# EAGLE design AST1037 (EAGLE 6.3)
DATABASE: ./../../../../../Components/TinyCircuits_Part_Database.txt
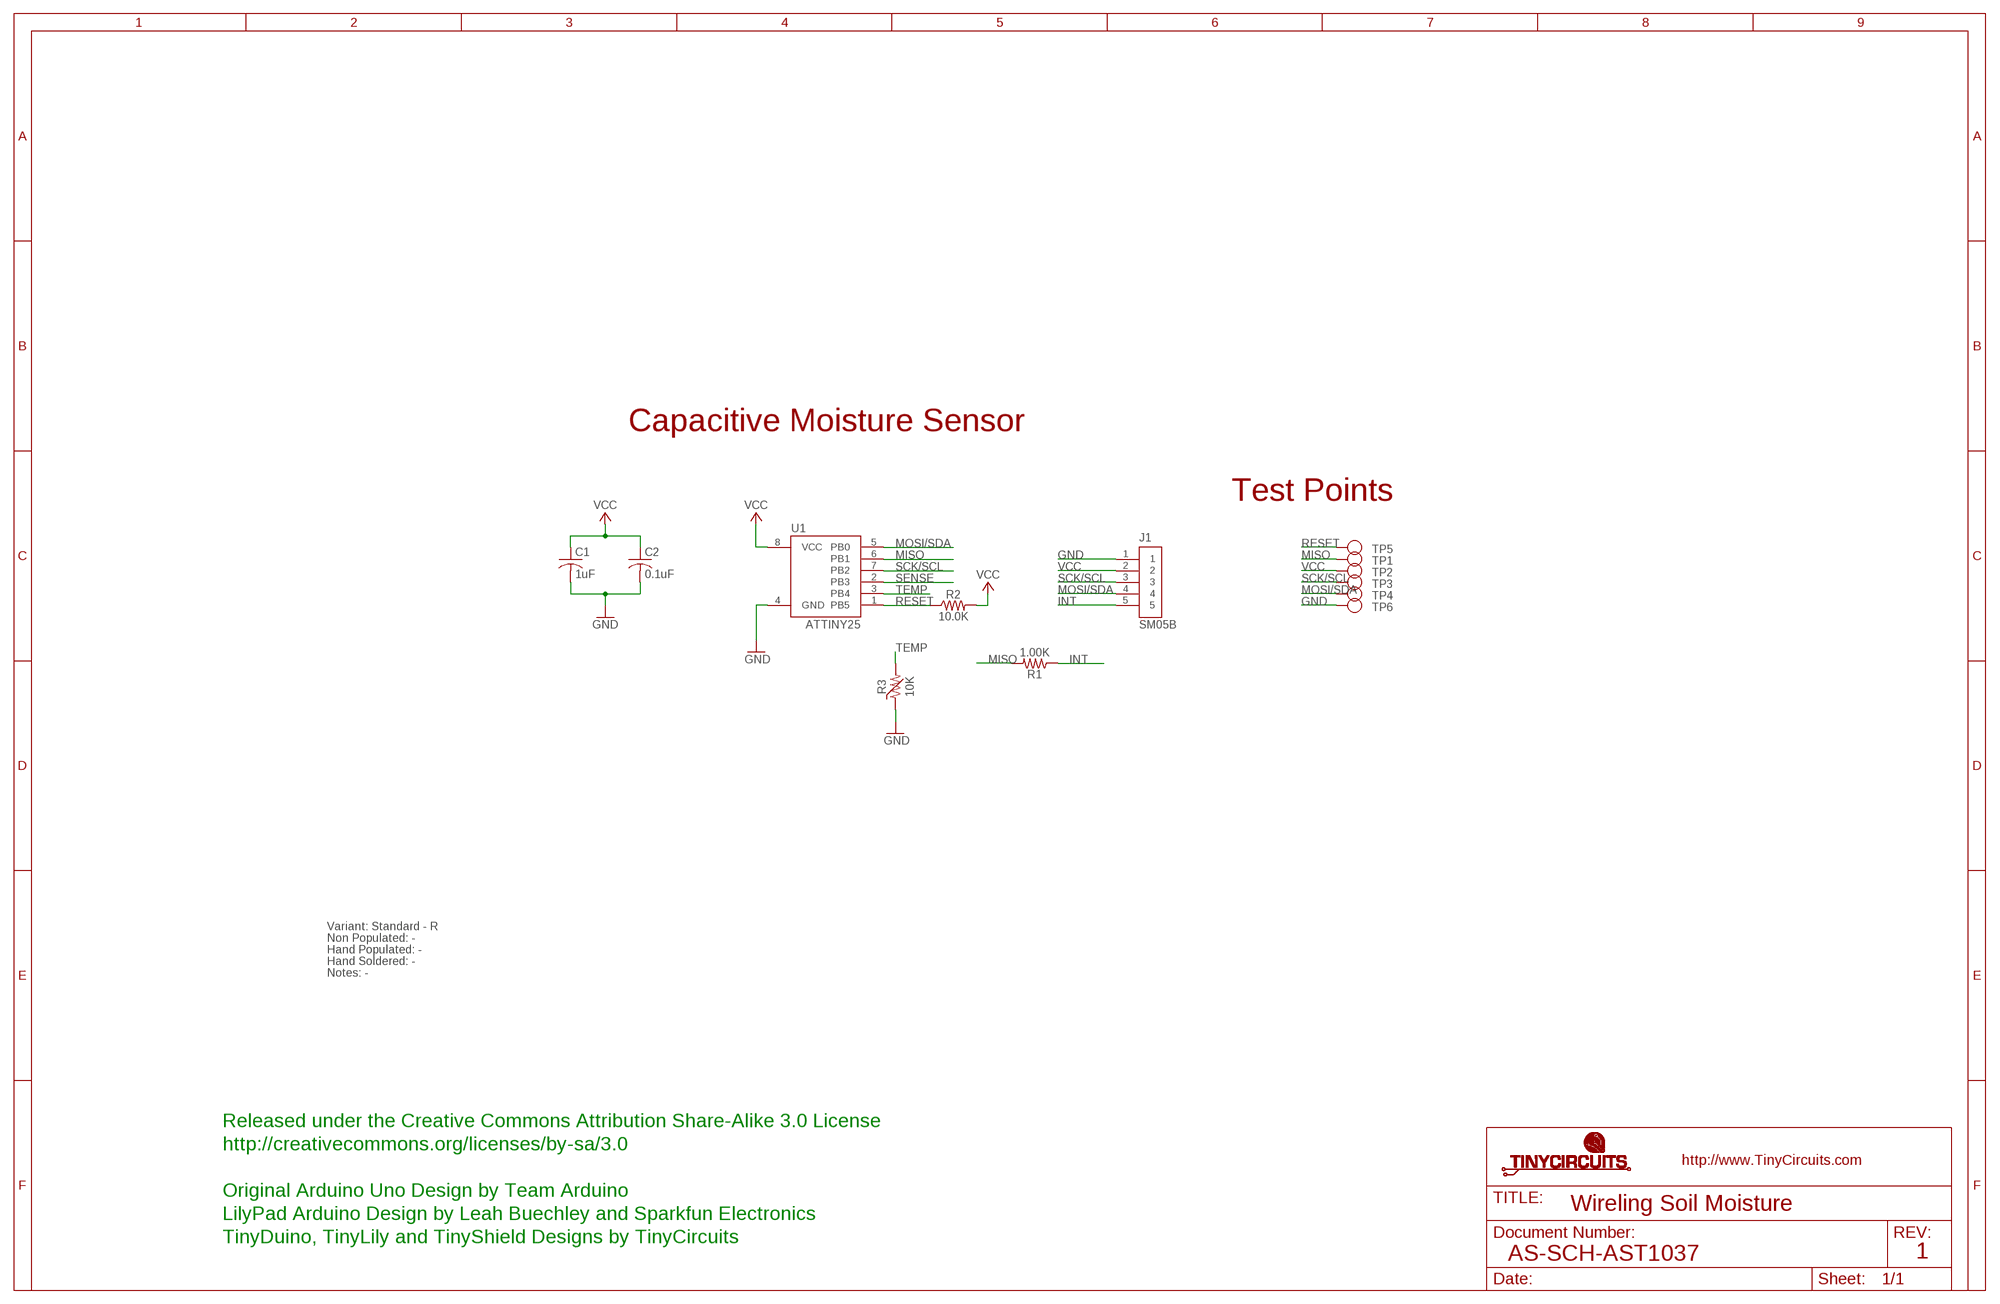
[diagram p0: schematic, sheet 1]

## Parts
C1  1uF  AS-ITM-00410  [C0603]
C2  0.1uF  AS-ITM-00008  [C0402]
J1  SM05B  AS-ITM-00340  [JST_SH_5X1]
R1  1.00K  AS-ITM-00003  [0402]
R2  10.0K  AS-ITM-00032  [0402]
R3  10K  AS-ITM-00524  [0402]
TP1  TEST_POINT  [TEST_POINT_1MM]
TP2  TEST_POINT  [TEST_POINT_1MM]
TP3  TEST_POINT  [TEST_POINT_1MM]
TP4  TEST_POINT  [TEST_POINT_1MM]
TP5  TEST_POINT  [TEST_POINT_1MM]
TP6  TEST_POINT  [TEST_POINT_1MM]
U1  ATTINY25  AS-ITM-00330  [SO-08-COMPACT]

## Nets
GND: C1.2 C2.2 J1.1 R3.1 TP6.P$1 U1.4(GND)
INT: J1.5 R1.1
MISO: R1.2 TP1.P$1 U1.6(PB1)
MOSI/SDA: J1.4 TP4.P$1 U1.5(PB0)
RESET: R2.1 TP5.P$1 U1.1(PB5)
SCK/SCL: J1.3 TP3.P$1 U1.7(PB2)
SENSE: U1.2(PB3)
TEMP: R3.2 U1.3(PB4)
VCC: C1.1 C2.1 J1.2 R2.2 TP2.P$1 U1.8(VCC)

## Notes on the sheet
- Capacitive Moisture Sensor
- Test Points
- Variant: Standard - R
- Non Populated: -
- Hand Populated: -
- Hand Soldered: -
- Notes: -
- Released under the Creative Commons Attribution Share-Alike 3.0 License
- http://creativecommons.org/licenses/by-sa/3.0
- Original Arduino Uno Design by Team Arduino
- Wireling Soil Moisture
- LilyPad Arduino Design by Leah Buechley and Sparkfun Electronics
- TinyDuino, TinyLily and TinyShield Designs by TinyCircuits
- AS-SCH-AST1037 | 1

## Library data of the parts
C1 = tinycircuits:AS-ITM-00410: CAP CER 1UF 10V X5R 0603; PARTNO: AS-ITM-00410
C2 = tinycircuits:AS-ITM-00008: CAP CER 0.1UF 16V 10% X5R 0402; PARTNO: AS-ITM-00008
J1 = tinycircuits:AS-ITM-00340: CONN HEADER SH 5POS SIDE 1MM TIN; PARTNO: AS-ITM-00340; PNPROTATION: 180
R1 = tinycircuits:AS-ITM-00003: RES 1.00K OHM 1/16W 1% 0402; PARTNO: AS-ITM-00003
R2 = tinycircuits:AS-ITM-00032: RES 10.0K OHM 1/16W 1% 0402 SMD; PARTNO: AS-ITM-00032
R3 = tinycircuits:AS-ITM-00524: THERMISTOR NTC 10KOHM 3380K 0402; PARTNO: AS-ITM-00524
TP1-TP6 = tinycircuits:TEST_POINT: Test point, no drill
U1 = tinycircuits:AS-ITM-00330: MCU AVR ATtiny Microcontroller IC 8-Bit 20MHz 2KB (1K x 16) FLASH 8-SOIC; PARTNO: AS-ITM-00330

## Net classes
2 gnd: width 0.305 mm, drill 0.559 mm, clearance 0.254 mm

## Board
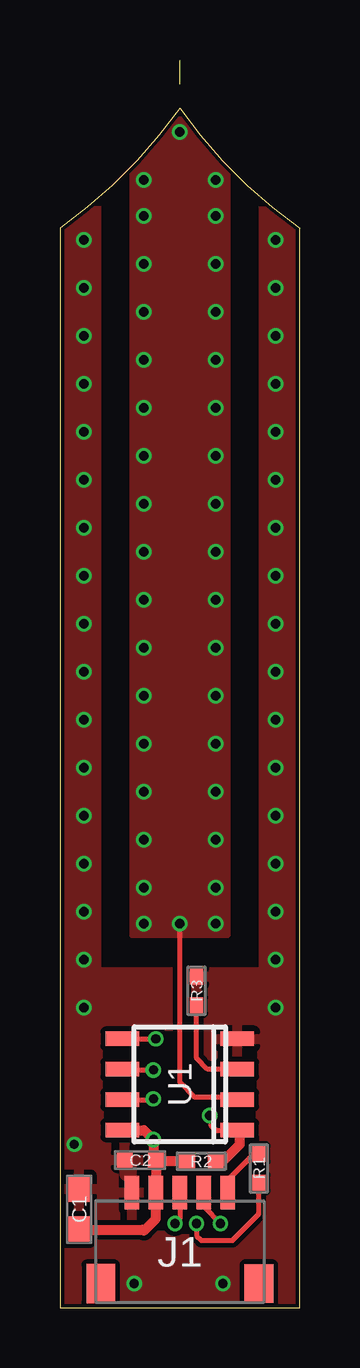
[diagram p1: board, top side]
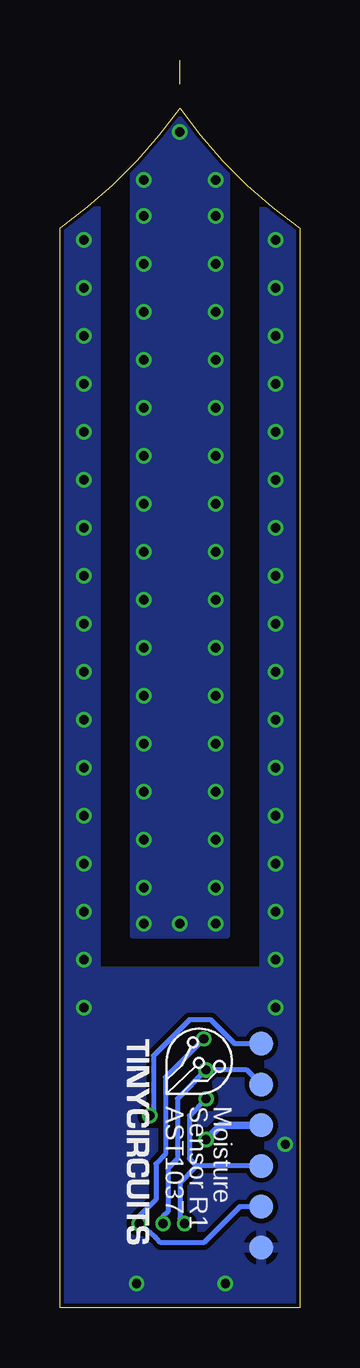
[diagram p2: board, bottom side, seen from below]

Size 10 x 52 mm. Coordinates in mm from the lower left corner, seen from the top.
Outline: 5,51 5,52
Outline: 0,0 10,0 10,45 arc-20 5,50 arc-20 0,45 0,0
Copper layers (1*16): Top 0.035mm / dielectric 1.5mm / Bottom 0.035mm
Design rules "default *": minimum track width 8mil, minimum drill 15mil, track to track 8mil, track to pad 8mil, pad to pad 8mil, via to via 8mil, smd to smd 8mil, copper to edge 6mil, drill to drill 8mil, minimum pad ring 8mil, minimum via ring 5mil, stop-mask expansion 4mil, vias tented up to drill 25mil, thermal gap 10mil

### Footprints (pad centres in the part's own frame; a part is rotated, then mirrored left to right if it is on the bottom)
C0603 = smd 1.1 x 1: 1 -0.85,0; 2 0.85,0
C0402 = smd 0.65 x 0.6: 1 -0.65,0; 2 0.65,0
JST_SH_5X1 = smd 0.6 x 1.4: 1 -2,2.475; 2 -1,2.475; 3 0,2.475; 4 1,2.475; 5 2,2.475 | smd 1.2 x 1.6: PAD1 -3.3,-1.325; PAD2 3.3,-1.325
0402 = smd 0.65 x 0.55: 1 -0.6,0; 2 0.6,0
TEST_POINT_1MM = smd 1 x 1: P$1 0,0
SO-08-COMPACT = smd 0.6 x 1.4: 1 -1.905,-2.4; 2 -0.635,-2.4; 3 0.635,-2.4; 4 1.905,-2.4; 5 1.905,2.4; 6 0.635,2.4; 7 -0.635,2.4; 8 -1.905,2.4

### Placement (x,y rotation side)
C1  0.8,4.1 90 top
C2  3.35,6.15 180 top
J1  5,2.33 0 top
R1  8.3,5.8 270 top
R2  5.9,6.1 180 top
R3  5.7,13.2 270 top
TP1  1.6,9.3 0 bottom
TP2  1.6,7.6 0 bottom
TP3  1.6,5.9 0 bottom
TP4  1.6,4.2 0 bottom
TP5  1.6,11 0 bottom
TP6  1.6,2.5 0 bottom
U1  5,9.3 90 top
U$1  [DOCFIELD-TINYCIRCUITS-PCB]  24,-5 0 top  (outside the outline)

### Tracks (layer width: path | path; a pad name or v marks a point on that pad's centre or on a via)
GND  (via drill 0.38)
  other vias: 0.6,6.8 3.1,1 6.8,1 1,16.5 1,18.5 1,20.5 1,22.5 1,24.5 1,26.5 1,28.5 1,30.5 1,32.5 1,34.5 1,36.5 1,38.5 1,40.5 1,42.5 1,44.5 9,16.5 9,18.5 9,20.5 9,22.5 9,24.5 9,26.5 9,28.5 9,30.5 9,32.5 9,34.5 9,36.5 9,38.5 9,40.5 9,42.5 9,44.5 9,14.5 1,14.5 1,12.5 9,12.5
  pour Top: 0,0 0,47.5 1.5,47.5 1.5,14 8.5,14 8.5,48 10,48 10,0
  pour Bottom: 0,0 0,47.5 1.5,47.5 1.5,14 8.5,14 8.5,48 10,48 10,0
INT
  Top 0.203: J1.5 7.1,4.9 7.1,5.4 8.1,6.4 R1.1
MISO  (via drill 0.38)
  Top 0.203: 2.63,9.9 v3.9,9.9 | v5.7,3.5 5.7,3 5.9,2.8 7.2,2.8 8.3,3.9 R1.2
  Top 0.305: U1.6 2.63,9.9
  Bottom 0.203: TP1.P$1 2.2,9.9 v3.9,9.9 5.1,8.7 5.1,6.2 5.5,5.8 5.5,4 5.7,3.8 v5.7,3.5
MOSI/SDA  (via drill 0.38)
  Top 0.203: J1.4 6,4.2 v6.7,3.5 | U1.5 v4,11.2
  Top 0.305: U1.5
  Bottom 0.203: TP4.P$1 2.5,4.2 4,2.7 5.8,2.7 6,2.9 v6.7,3.5 6.7,3.8 6,4.5 6,6 5.6,6.4 5.6,9.6 v4,11.2
RESET  (via drill 0.38)
  Top 0.203: v6.25,8 6.3,7.6 6.5,7.39 U1.1
  Top 0.406: R2.1 6.8,6.1 7.5,6.8 7.5,7.29 U1.1
  Bottom 0.203: TP5.P$1 2.7,11 3.7,12 4.6,12 6.1,10.5 6.1,8.2 v6.25,8
SCK/SCL  (via drill 0.38)
  Top 0.203: J1.3 5,3.7 v4.8,3.5 | U1.7 3.87,8.66 v3.9,8.7
  Bottom 0.203: TP3.P$1 4.3,5.9 | 4.3,5.9 5,5.2 5,3.7 v4.8,3.5 | v3.9,8.7 4.6,8 4.6,6.2 4.3,5.9
SENSE  (via drill 0.38)
  Top 0.203: U1.2 6.9,8.7 6.84,8.77 5.63,8.77 5,9.4 v5,16
  other vias: 3.5,17.5 3.5,16 6.5,16 3.5,19.5 6.5,17.5 6.5,19.5 6.5,21.5 6.5,23.5 3.5,21.5 3.5,23.5 3.5,25.5 3.5,27.5 3.5,29.5 3.5,31.5 3.5,33.5 3.5,35.5 3.5,37.5 3.5,39.5 3.5,41.5 3.5,43.5 3.5,45.5 3.5,47 5,49 6.5,47 6.5,45.5 6.5,43.5 6.5,25.5 6.5,27.5 6.5,29.5 6.5,31.5 6.5,33.5 6.5,35.5 6.5,37.5 6.5,39.5 6.5,41.5
  pour Top: 3,50 7,50 7,15.5 3,15.5
  pour Bottom: 3,50 7,50 7,15.5 3,15.5
TEMP
  Top 0.203: U1.3 6.16,9.94 5.7,10.4 R3.2
VCC  (via drill 0.38)
  Top 0.406: U1.8 3.51,7.39 v3.9,7 3.9,6.2 C2.1 | C2.1 J1.2 4,3.7 3.5,3.2 3.45,3.25 C1.1 | R2.2 4.05,6.1 C2.1
  Bottom 0.305: TP2.P$1 3.3,7.6 v3.9,7

### Text on the board
bPlace: Moisture | Sensor R1 | AST1037
Document: FABRICATION DRAWING | NOTES: | 1. PRINTED CIRCUIT BOARD MADE FROM NEMA GRADE FR-4 EPOXY LAMINATE | WITH 1 OUNCE COPPER PLATING AND .024 THICKNESS. | 2. ALL DIMENSIONS ARE GIVEN IN MILLIMETERS. | 3. CIRCUIT PATHS ARE FOR REFERENCE ONLY. | 4. HOLE SIZES SHOWN ARE FINISHED DIAMETERS AFTER PLATING. | 5. BOARD PLATED USING REFLOW OR SIMILAR METHOD. | 6. BOARD TO HAVE BLUE SOLDER MASK ON PLATED SURFACES USING WET FILM | 7. SILKSCREEN BOARD USING WHITE INK. | SR100 OR SR1010 EPOXY. EQUIVALENT WET OR DRY FILM MAY BE USED. | 8. THE FOLLOWING INFORMATION APPLIES TO THIS BOARD: | * 2 COPPER LAYERS | * .024 BOARD THICKNESS | * REQUIRES TOP SIDE SILKSCREEN | Released under the Creative Commons Attribution Share-Alike 3.0 License | http://creativecommons.org/licenses/by-sa/3.0 | Original Arduino Uno Design by Team Arduino | LilyPad Arduino Design by Leah Buechley and Sparkfun Electronics | TinyDuino, TinyLily and TinyShield Designs by TinyCircuits | Wireling Soil Moisture | AS-PCB-AST1037 | 1